# Altium project PCB_ProjectElectroporation.PrjPcb
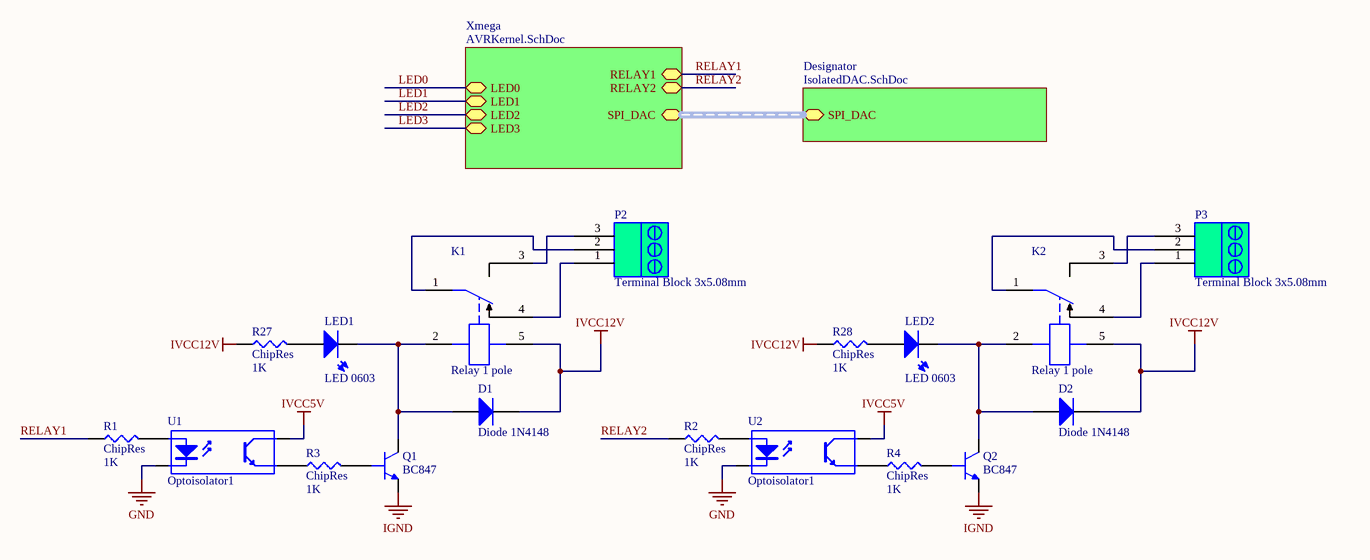
[diagram p0: main.SchDoc]
3 sheets, 103 parts. Net scope: hierarchical (ports join the sheet entries above them; power ports are global).
Board file: ElectroporationPCB.PcbDoc
Sheets:
  main.SchDoc
    Xmega = AVRKernel.SchDoc
    Designator = IsolatedDAC.SchDoc

## Sheet main.SchDoc
size A4

### Parts
D1  Diode 1N4148  [DO-35]
D2  Diode 1N4148  [DO-35]
K1  Relay 1 pole  [G5LA]
K2  Relay 1 pole  [G5LA]
LED1  LED 0603  [LED 0603]
LED2  LED 0603  [LED 0603]
P2  Terminal Block 3x5.08mm  [Socket 3x5.08]
P3  Terminal Block 3x5.08mm  [Socket 3x5.08]
Q1  BC847  [SOT23]
Q2  BC847  [SOT23]
R1  ChipRes  value 1K  [RES0805]
R2  ChipRes  value 1K  [RES0805]
R3  ChipRes  value 1K  [RES0805]
R4  ChipRes  value 1K  [RES0805]
R27  ChipRes  value 1K  [RES0805]
R28  ChipRes  value 1K  [RES0805]
U1  Optoisolator1  [DIP-4]
U2  Optoisolator1  [DIP-4]

### Sub-sheets
Designator = IsolatedDAC.SchDoc: SPI_DAC (harness SPI)
Xmega = AVRKernel.SchDoc: RELAY1, RELAY2, SPI_DAC (harness SPI), LED0, LED1, LED2, LED3

### Nets
GND: U1.2(K) U2.2(K)
IGND: Q1.2 Q2.2
IVCC5V: U1.4(C) U2.4(C)
IVCC12V: D1.2(K) D2.2(K) K1.5 K2.5 R27.1 R28.1
RELAY1: R1.1 ; sheet Xmega/RELAY1
RELAY2: R2.1 ; sheet Xmega/RELAY2
NetD1_1: D1.1(A) K1.2 LED1.1 Q1.3
NetD2_1: D2.1(A) K2.2 LED2.1 Q2.3
NetK1_1: K1.1 P2.2
NetK1_3: K1.3 P2.3
NetK1_4: K1.4 P2.1
NetK2_1: K2.1 P3.2
NetK2_3: K2.3 P3.3
NetK2_4: K2.4 P3.1
NetLED1_2: LED1.2 R27.2
NetLED2_2: LED2.2 R28.2
NetQ1_1: Q1.1 R3.2
NetQ2_1: Q2.1 R4.2
NetR1_2: R1.2 U1.1(A)
NetR2_2: R2.2 U2.1(A)
NetR3_1: R3.1 U1.3(E)
NetR4_1: R4.1 U2.3(E)

### Buses and harness runs
harness sheet Designator/SPI_DAC = sheet Xmega/SPI_DAC

### Library data of the parts
D1 D2 = Diode 1N4148: High Conductance Fast Diode; Published: 8-Jun-2000; LatestRevisionDate: 17-Jul-2002; LatestRevisionNote: Re-released for DXP Platform.; DatasheetVersion: 1997; PackageReference: DO-35; Publisher: Altium Limited; PackageDescription: Diode, Axial; Body 3.8 x 1.9 mm (LxDia. max), Lead Dia. 0.53 mm (max); Code_JEDEC: DO-204-AH; ComponentLink1Description: Manufacturer Link; ComponentLink1URL: http://www.fairchildsemi.com/; ComponentLink2Description: Datasheet; ComponentLink2URL: http://www.fairchildsemi.com/ds/1N%2F1N4148.pdf
K1 K2 = Relay G5LE: Relay G5LE 10A Single Pole
LED1 LED2 = LED0603
P2 P3 = Socket_3x5.08_RA_2Wall: Terminal Block Socket Right Angle 3x5.08mm 2-Wall
Q1 Q2 = BC847: NPN transistor
R1-R4 R27 R28 = ChipRes: Chip resistor
U1 U2 = Optoisolator1: 4-Pin Phototransistor Optocoupler; Published: 24-Mar-1999; LatestRevisionDate: 04-Mar-2005; LatestRevisionNote: Sch pins 3 & 4 Swapped.; DatasheetVersion: Nov-2003; PackageReference: DIP-4; Publisher: Altium Limited

## Sheet AVRKernel.SchDoc
size A4
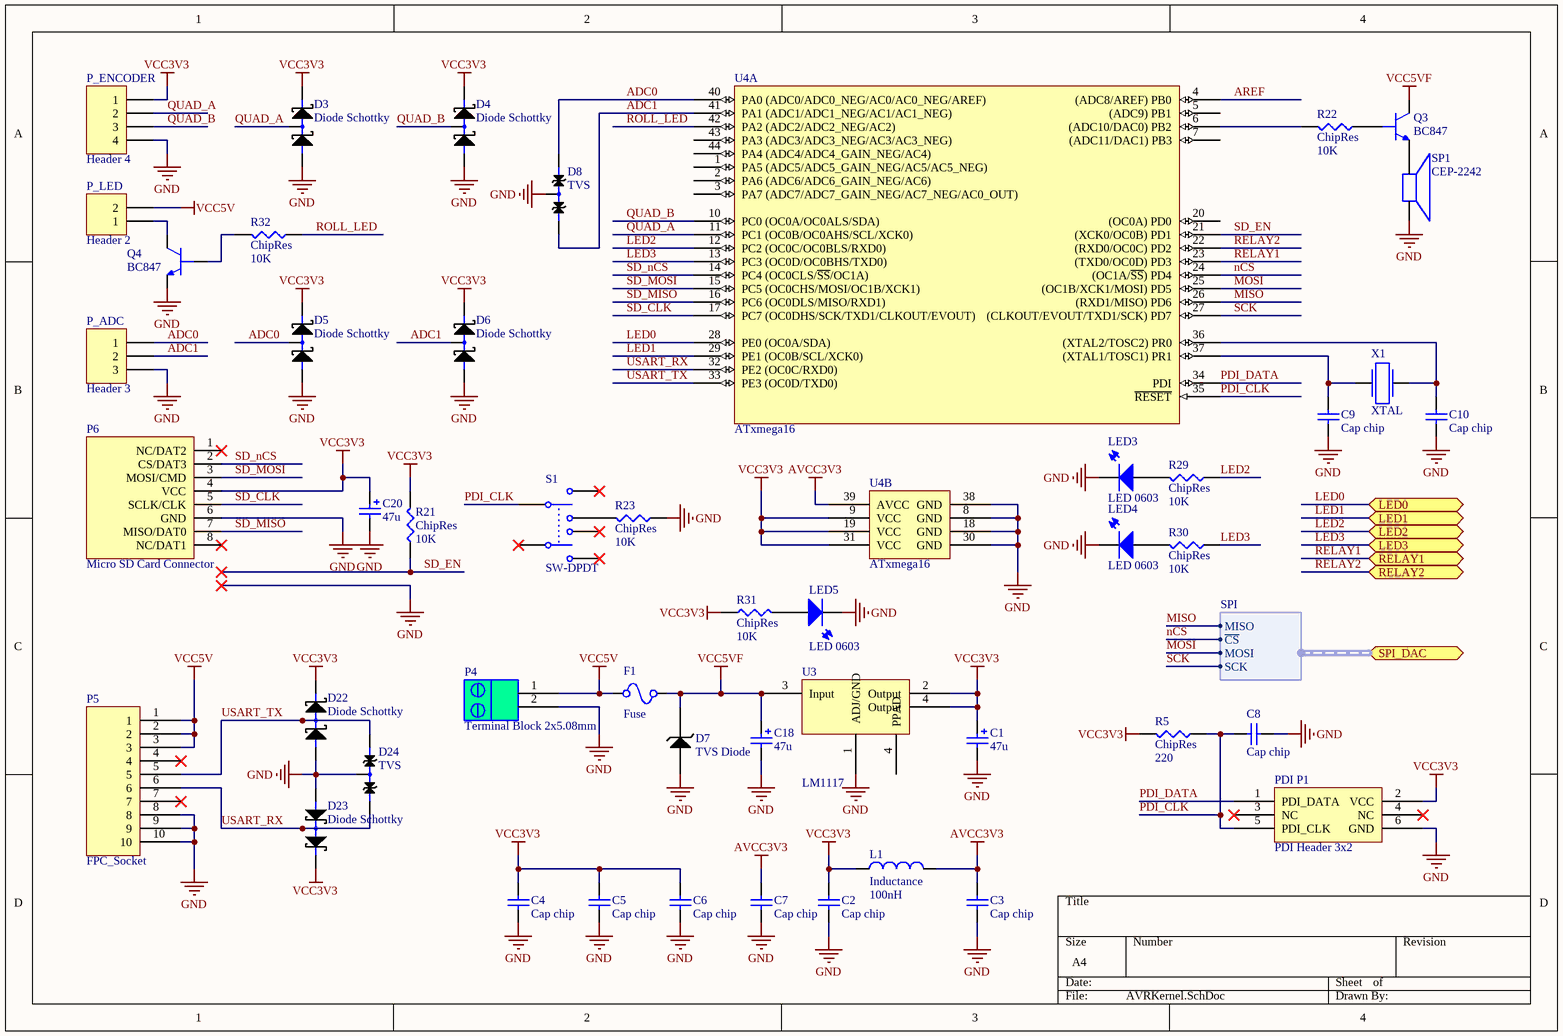
[diagram p1: AVRKernel.SchDoc]

### Parts
C1  value 47u  [CAPC7343]  (hidden comment: Cap Pol SMD)
C2  Cap chip  [CAPC3216]
C3  Cap chip  [CAPC3216]
C4  Cap chip  [CAPC3216]
C5  Cap chip  [CAPC3216]
C6  Cap chip  [CAPC3216]
C7  Cap chip  [CAPC3216]
C8  Cap chip  [CAPC3216]
C9  Cap chip  [CAPC3216]
C10  Cap chip  [CAPC3216]
C18  value 47u  [CAPC7343]  (hidden comment: Cap Pol SMD)
C20  value 47u  [CAPC7343]  (hidden comment: Cap Pol SMD)
D3  Diode Schottky  [SOT23]
D4  Diode Schottky  [SOT23]
D5  Diode Schottky  [SOT23]
D6  Diode Schottky  [SOT23]
D7  TVS Diode  [DO-214AS]
D8  TVS  [SOT23]
D22  Diode Schottky  [SOT23]
D23  Diode Schottky  [SOT23]
D24  TVS  [SOT23]
F1  Fuse  [PTC1812]
L1  Inductance  value 100nH  [CM45]
LED3  LED 0603  [LED 0603]
LED4  LED 0603  [LED 0603]
LED5  LED 0603  [LED 0603]
P4  Terminal Block 2x5.08mm  [Socket 2x5.08]
P5  FPC_Socket  [Molex FPC/FFC 10pin]
P6  Micro SD Card Connector  [WR-CRD SD Micro]
P_ADC  Header 3  [HDR1X3]
P_ENCODER  Header 4  [HDR1X4]
P_LED  Header 2  [HDR1X2]
PDI_P1  PDI Header 3x2  [Header 3x2]
Q3  BC847  [SOT23]
Q4  BC847  [SOT23]
R5  ChipRes  value 220  [RES0805]
R21  ChipRes  value 10K  [RES0805]
R22  ChipRes  value 10K  [RES0805]
R23  ChipRes  value 10K  [RES0805]
R29  ChipRes  value 10K  [RES0805]
R30  ChipRes  value 10K  [RES0805]
R31  ChipRes  value 10K  [RES0805]
R32  ChipRes  value 10K  [RES0805]
S1  SW-DPDT  [DPDT-6]
SP1  CEP-2242  [Buzzer]
U3  LM1117  [SOT223-4M]
U4  ATxmega16  [44A_L]  (parts A,B of 2)
X1  XTAL  [BCY-W2/E4.7]

### Ports
LED0, LED1, LED2, LED3, RELAY1, RELAY2, SPI_DAC (harness SPI)

### Harnesses
SPI: MOSI, MISO, SCK, ~{CS}

### Nets
AVCC3V3: C3.1 C7.2 L1.1 U4.39(AVCC)
GND: C1.2 C2.2 C3.2 C4.1 C5.1 C6.1 C7.1 C8.1 C9.1 C10.1 C18.2 C20.2 D3.1 D4.1 D5.1 D6.1 D7.2 D8.3 D22.1 D23.1 D24.3 LED3.1 LED4.1 LED5.1 P4.2 P5.8 P5.9 P5.10 P6.6(GND) P_ADC.3 P_ENCODER.4 PDI_P1.6(GND) Q4.2 R23.1 SP1.2 U3.1(ADJ/GND) U4.8(GND) U4.18(GND) U4.30(GND) U4.38(GND)
VCC3V3: C1.1 C2.1 C4.2 C5.2 C6.2 C20.1 D3.2 D4.2 D5.2 D6.2 D22.2 D23.2 L1.2 P6.4(VCC) P_ENCODER.1 PDI_P1.2(VCC) R5.2 R21.2 R31.1 U3.2(Output) U3.4(PPAD) U4.9(VCC) U4.19(VCC) U4.31(VCC)
VCC5V: F1.1 P4.1 P5.1 P5.2 P5.3 P_LED.2
VCC5VF: C18.1 D7.1 F1.2 Q3.3 U3.3(Input)
ADC0: D5.3 D8.1 P_ADC.1 U4.40(PA0_(ADC0/ADC0_NEG/AC0/AC0_NEG/AREF))
ADC1: D6.3 D8.2 P_ADC.2 U4.41(PA1_(ADC1/ADC1_NEG/AC1/AC1_NEG))
AREF: U4.4((ADC8/AREF)_PB0)
LED0: U4.28(PE0_(OC0A/SDA)) ; port LED0
LED1: U4.29(PE1_(OC0B/SCL/XCK0)) ; port LED1
LED2: R29.1 U4.12(PC2_(OC0C/OC0BLS/RXD0)) ; port LED2
LED3: R30.1 U4.13(PC3_(OC0D/OC0BHS/TXD0)) ; port LED3
MISO: U4.26((RXD1/MISO)_PD6) ; port SPI_DAC.MISO
MOSI: U4.25((OC1B/XCK1/MOSI)_PD5) ; port SPI_DAC.MOSI  [project net DAC_MOSI]
nCS: U4.24((OC1A/~{SS})_PD4) ; port SPI_DAC.~{CS}  [project net DAC_CS]
PDI_CLK: C8.2 PDI_P1.5(PDI_CLK) R5.1 S1.1 U4.35(~{RESET})
PDI_DATA: PDI_P1.1(PDI_DATA) U4.34(PDI)
QUAD_A: D3.3 P_ENCODER.2 U4.11(PC1_(OC0B/OC0AHS/SCL/XCK0))
QUAD_B: D4.3 P_ENCODER.3 U4.10(PC0_(OC0A/OC0ALS/SDA))
RELAY1: U4.23((TXD0/OC0D)_PD3) ; port RELAY1
RELAY2: U4.22((RXD0/OC0C)_PD2) ; port RELAY2
ROLL_LED: R32.1 U4.42(PA2_(ADC2/ADC2_NEG/AC2))
SCK: U4.27((CLKOUT/EVOUT/TXD1/SCK)_PD7) ; port SPI_DAC.SCK  [project net DAC_SCK]
SD_CLK: P6.5(SCLK/CLK) U4.17(PC7_(OC0DHS/SCK/TXD1/CLKOUT/EVOUT))
SD_EN: R21.1 U4.21((XCK0/OC0B)_PD1)
SD_MISO: P6.7(MISO/DAT0) U4.16(PC6_(OC0DLS/MISO/RXD1))
SD_MOSI: P6.3(MOSI/CMD) U4.15(PC5_(OC0CHS/MOSI/OC1B/XCK1))
SD_nCS: P6.2(CS/DAT3) U4.14(PC4_(OC0CLS/~{SS}/OC1A))
USART_RX: D23.3 D24.2 P5.6 U4.32(PE2_(OC0C/RXD0))
USART_TX: D22.3 D24.1 P5.5 U4.33(PE3_(OC0D/TXD0))
NetC9_2: C9.2 U4.37((XTAL1/TOSC1)_PR1) X1.1
NetC10_2: C10.2 U4.36((XTAL2/TOSC2)_PR0) X1.2
NetLED3_2: LED3.2 R29.2
NetLED4_2: LED4.2 R30.2
NetLED5_2: LED5.2 R31.2
NetP_LED_1: P_LED.1 Q4.3
NetQ3_1: Q3.1 R22.1
NetQ3_2: Q3.2 SP1.1
NetQ4_1: Q4.1 R32.2
NetR22_2: R22.2 U4.6((ADC10/DAC0)_PB2)
NetR23_2: R23.2 S1.3

Not connected (* = marked no-connect by the designer): P5 4* 7*; P6 1(NC/DAT2)* 8(NC/DAT1)*; PDI_P1 3(NC)* 4(NC)*; S1 2* 4* 5* 6*; U4 1(PA5_(ADC5/ADC5_GAIN_NEG/AC5/AC5_NEG)) 2(PA6_(ADC6/ADC6_GAIN_NEG/AC6)) 3(PA7_(ADC7/ADC7_GAIN_NEG/AC7_NEG/AC0_OUT)) 5((ADC9)_PB1) 7((ADC11/DAC1)_PB3) 20((OC0A)_PD0) 43(PA3_(ADC3/ADC3_NEG/AC3/AC3_NEG)) 44(PA4_(ADC4/ADC4_GAIN_NEG/AC4))

### Library data of the parts
C1 C18 C20 = Cap Pol Chip: Polarized Capacitor (Radial); Supplier 1: Digi-Key; Supplier Part Number 1: 399-4029-1-ND
C2-C10 = Cap chip: Chip Capacitor; Value: 0.01uF; Published: 8-Jun-2000; LatestRevisionDate: 17-Jul-2002; LatestRevisionNote: Re-released for DXP Platform.; PackageReference: RAD-0.3; Publisher: Altium Limited; Supplier 1: Digi-Key; Supplier Part Number 1: 399-1249-1-ND
D3-D6 D22 D23 = Schottky Diode: 2-Diode Schottky
D7 = TVS Diode SMA
D8 D24 = TVS Diode: Dual bidirectional voltage supresor
F1 = Fuse PTC1812: Fuse PTC 1812 Thermoresistor
L1 = ChipInductance
LED3-LED5 = LED0603
P4 = Socket_2x5.08_RA_2Wall: Terminal Block Socket Right Angle 2x5.08mm 2 Wall
P6 = MicroSDHeader8
P_ADC = Header 3: Header, 3-Pin; LatestRevisionDate: 17-Jul-2002; LatestRevisionNote: Re-released for DXP Platform.; Publisher: Altium Limited
P_ENCODER = Header 4: Header, 4-Pin; LatestRevisionDate: 17-Jul-2002; LatestRevisionNote: Re-released for DXP Platform.; Publisher: Altium Limited
P_LED = Header 2: Header, 2-Pin; LatestRevisionDate: 17-Jul-2002; LatestRevisionNote: Re-released for DXP Platform.; Publisher: Altium Limited
PDI_P1 = PDI Header 3x2: PDI Interface connector
Q3 Q4 = BC847: NPN transistor
R5 R21-R23 R29-R32 = ChipRes: Chip resistor
S1 = SW-DPDT: Double-Pole, Double-Throw Switch; Published: 24-Mar-1999; LatestRevisionDate: 17-Jul-2002; LatestRevisionNote: Re-released for DXP Platform.; PackageReference: DPDT-6; Publisher: Altium Limited; PackageDescription: Switch; 6 Leads
SP1 = Buzzer CEP-2242: Buzzer
U3 = LM1117: Power Mgt Voltage Regulator
U4 = ATxmega16: 8-Bit AVR XMEGA Microcontroller with 16K Bytes of In-System Programmable Flash Memory
X1 = Crystall oscillator: Quartz crystall oscillator

## Sheet IsolatedDAC.SchDoc
size A4
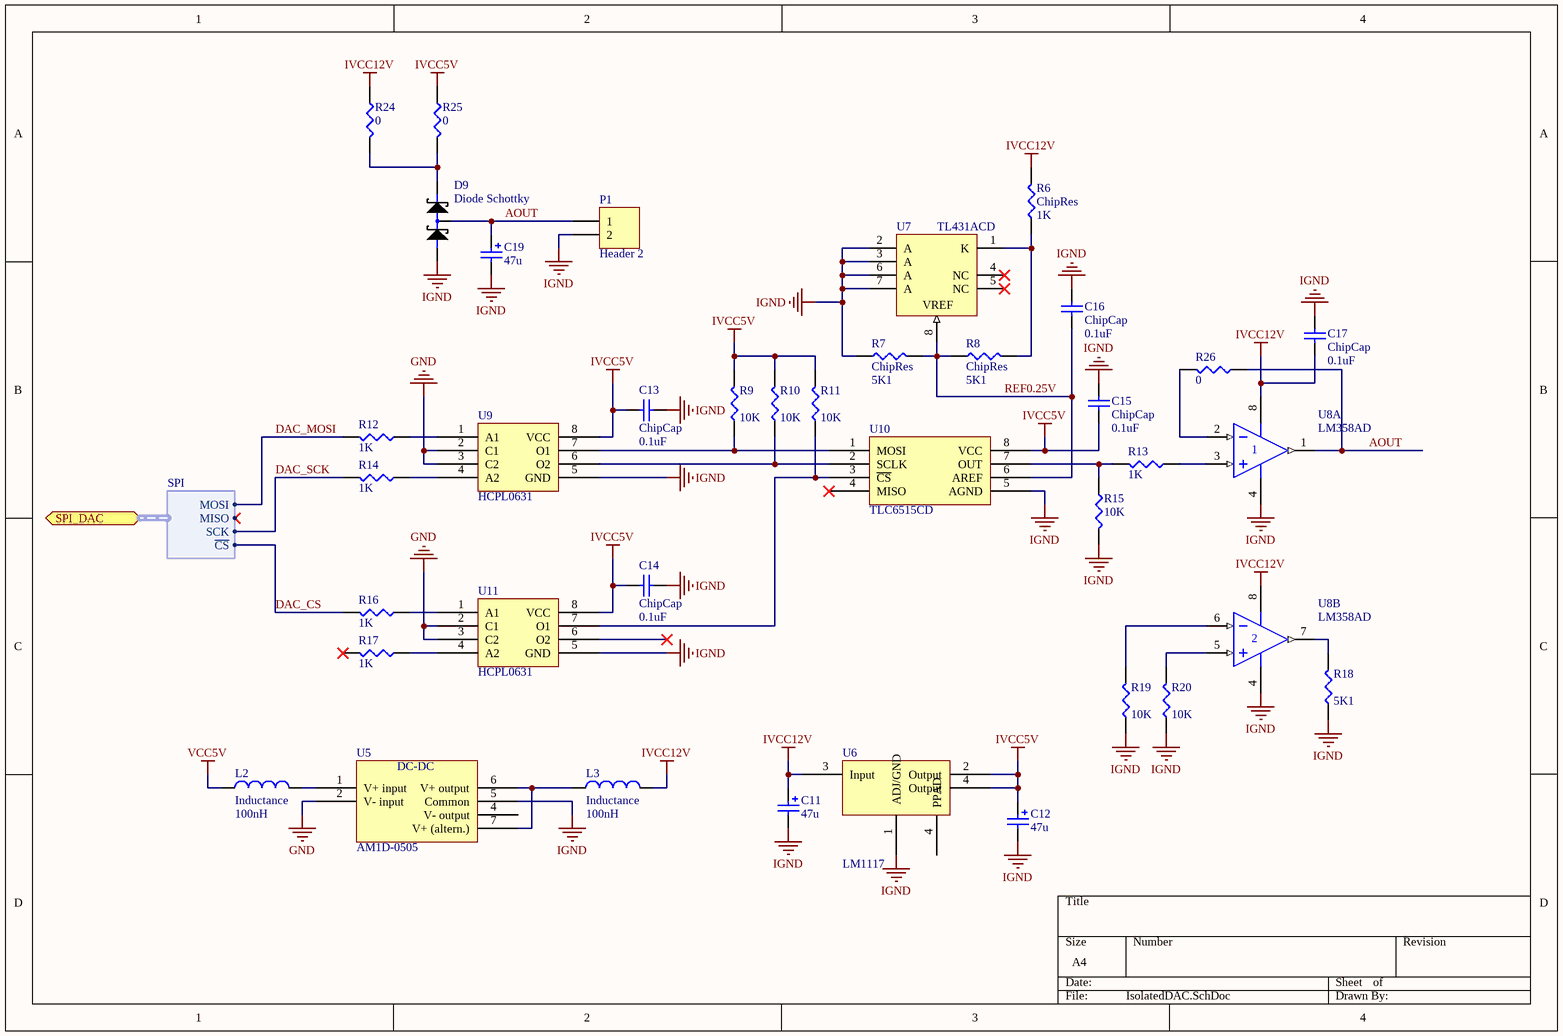
[diagram p2: IsolatedDAC.SchDoc]

### Parts
C11  value 47u  [CAPC7343]  (hidden comment: Cap Pol SMD)
C12  value 47u  [CAPC7343]  (hidden comment: Cap Pol SMD)
C13  ChipCap  value 0.1uF  [CAP0805]
C14  ChipCap  value 0.1uF  [CAP0805]
C15  ChipCap  value 0.1uF  [CAP0805]
C16  ChipCap  value 0.1uF  [CAP0805]
C17  ChipCap  value 0.1uF  [CAP0805]
C19  value 47u  [CAPC7343]  (hidden comment: Cap Pol SMD)
D9  Diode Schottky  [SOT23]
L2  Inductance  value 100nH  [CM32]
L3  Inductance  value 100nH  [CM32]
P1  Header 2  [HDR1X2]
R6  ChipRes  value 1K  [RES0805]
R7  ChipRes  value 5K1  [RES0805]
R8  ChipRes  value 5K1  [RES0805]
R9  value 10K  [RES0805]  (hidden comment: ChipRes)
R10  value 10K  [RES0805]  (hidden comment: ChipRes)
R11  value 10K  [RES0805]  (hidden comment: ChipRes)
R12  value 1K  [RES0805]  (hidden comment: ChipRes)
R13  value 1K  [RES0805]  (hidden comment: ChipRes)
R14  value 1K  [RES0805]  (hidden comment: ChipRes)
R15  value 10K  [RES0805]  (hidden comment: ChipRes)
R16  value 1K  [RES0805]  (hidden comment: ChipRes)
R17  value 1K  [RES0805]  (hidden comment: ChipRes)
R18  value 5K1  [RES0805]  (hidden comment: ChipRes)
R19  value 10K  [RES0805]  (hidden comment: ChipRes)
R20  value 10K  [RES0805]  (hidden comment: ChipRes)
R24  value 0  [RES0805]  (hidden comment: ChipRes)
R25  value 0  [RES0805]  (hidden comment: ChipRes)
R26  value 0  [RES0805]  (hidden comment: ChipRes)
U5  AM1D-0505  [SIP14]
U6  LM1117  [SOT223-4M]
U7  TL431ACD  [D008_N]
U8  LM358AD  [D008_L]  (parts A,B of 2)
U9  HCPL0631  [SOIC8]
U10  TLC6515CD  [SOIC8]
U11  HCPL0631  [SOIC8]

### Ports
SPI_DAC (harness SPI)

### Harnesses
SPI: MOSI, MISO, SCK, ~{CS}

### Nets
GND: U5.2(V-_input) U9.2(C1) U9.3(C2) U11.2(C1) U11.3(C2)
IGND: C11.2 C12.2 C13.1 C14.1 C15.1 C16.1 C17.1 C19.2 D9.1 P1.2 R7.1 R15.2 R18.1 R19.1 R20.1 U5.5(Common) U6.1(ADJ/GND) U7.2(A) U7.3(A) U7.6(A) U7.7(A) U8.4(V-) U9.5(GND) U10.5(AGND) U11.5(GND)
IVCC5V: C12.1 C13.2 C14.2 C15.2 R9.2 R10.2 R11.2 R25.1 U6.2(Output) U6.4(PPAD) U9.8(VCC) U10.8(VCC) U11.8(VCC)
IVCC12V: C11.1 C17.2 L3.1 R6.2 R24.1 U6.3(Input) U8.8(V+)
VCC5V: L2.2
AOUT: C19.1 D9.3 P1.1 R26.1 U8.1(OUT)
DAC_CS: R16.2 ; port SPI_DAC.~{CS}
DAC_MOSI: R12.2 ; port SPI_DAC.MOSI
DAC_SCK: R14.2 ; port SPI_DAC.SCK
REF0.25V: C16.2 R7.2 R8.1 U7.8(VREF) U10.6(AREF)
NetD9_2: D9.2 R24.2 R25.2
NetL2_1: L2.1 U5.1(V+_input)
NetL3_2: L3.2 U5.6(V+_output) U5.7(V+_(altern.))
NetR6_1: R6.1 R8.2 U7.1(K)
NetR9_1: R9.1 U9.7(O1) U10.1(MOSI)
NetR10_1: R10.1 U9.6(O2) U10.2(SCLK)
NetR11_1: R11.1 U10.3(~{CS}) U11.7(O1)
NetR12_1: R12.1 U9.1(A1)
NetR13_1: R13.1 U8.3(IN+)
NetR13_2: R13.2 R15.1 U10.7(OUT)
NetR14_1: R14.1 U9.4(A2)
NetR16_1: R16.1 U11.1(A1)
NetR17_1: R17.1 U11.4(A2)
NetR18_2: R18.2 U8.7(OUT)
NetR19_2: R19.2 U8.6(IN-)
NetR20_2: R20.2 U8.5(IN+)
NetR26_2: R26.2 U8.2(IN-)

Not connected (* = marked no-connect by the designer): R17 2*; U5 4(V-_output); U7 4(NC)* 5(NC)*; U10 4(MISO)*; U11 6(O2)*

### Notes on the sheet
- (in symbol AM1D-0512) DC-DC

### Library data of the parts
C11 C12 C19 = Cap Pol Chip: Polarized Capacitor (Radial); Supplier 1: Digi-Key; Supplier Part Number 1: 399-4029-1-ND
C13-C17 = ChipCap: Capacitor; Published: 8-Jun-2000; LatestRevisionDate: 17-Jul-2002; LatestRevisionNote: Re-released for DXP Platform.; PackageReference: RAD-0.3; Publisher: Altium Limited
D9 = Schottky Diode: 2-Diode Schottky
L2 L3 = ChipInductance
P1 = Header 2: Header, 2-Pin; LatestRevisionDate: 17-Jul-2002; LatestRevisionNote: Re-released for DXP Platform.; Publisher: Altium Limited
R6-R20 R24-R26 = ChipRes: Chip resistor
U5 = AM1D-0512: DC-DC 5-12V convertor
U6 = LM1117: Power Mgt Voltage Regulator
U7 = TL431ACD: Adjustable Precision Shunt Regulator; Published: 15-Apr-2002; LatestRevisionDate: 13-Apr-2006; LatestRevisionNote: IPC-7351 Footprint Added.; DatasheetVersion: Oct-2000; PackageVersion: Jan-1998; PackageReference: D008; Publisher: Altium Limited; PackageDescription: 8-Pin Small Outline Integrated Circuit 1.27 mm Pitch; Code_IPC: SOIC127P600-8; ComponentLink1Description: Manufacturer Link; ComponentLink1URL: http://www.ti.com/; ComponentLink2Description: Datasheet; ComponentLink2URL: http://www-s.ti.com/sc/ds/tl431a.pdf
U8 = LM358AD: Dual Operational Amplifier; Published: 15-Apr-2002; LatestRevisionDate: 13-Apr-2006; LatestRevisionNote: IPC-7351 Footprint Added.; DatasheetVersion: Aug-1988; PackageVersion: Jan-1998; PackageReference: D008; Publisher: Altium Limited; PackageDescription: 8-Pin Small Outline Integrated Circuit 1.27 mm Pitch; Code_IPC: SOIC127P600-8; ComponentLink1Description: Manufacturer Link; ComponentLink1URL: http://www.ti.com/; ComponentLink2Description: Datasheet; ComponentLink2URL: http://www-s.ti.com/sc/ds/lm358.pdf
U9 U11 = HCPL0631: 2-channel opto-coupler
U10 = TLC6515: 10-bit analog to digiyal converter; Manufacturer: Texas Instruments

## Nets that join several sheets
GND: main (U1.2 U2.2), AVRKernel (40 pins), IsolatedDAC (5 pins)
IGND: main (Q1.2 Q2.2), IsolatedDAC (25 pins)
IVCC5V: main (U1.4 U2.4), IsolatedDAC (13 pins)
IVCC12V: main (6 pins), IsolatedDAC (7 pins)
VCC5V: AVRKernel (6 pins), IsolatedDAC (L2.2)
DAC_CS: AVRKernel (U4.24), IsolatedDAC (R16.2)
DAC_MOSI: AVRKernel (U4.25), IsolatedDAC (R12.2)
DAC_SCK: AVRKernel (U4.27), IsolatedDAC (R14.2)
RELAY1: main (R1.1), AVRKernel (U4.23)
RELAY2: main (R2.1), AVRKernel (U4.22)